# Altium schematic sheet AV Channel.SchDoc
size A4
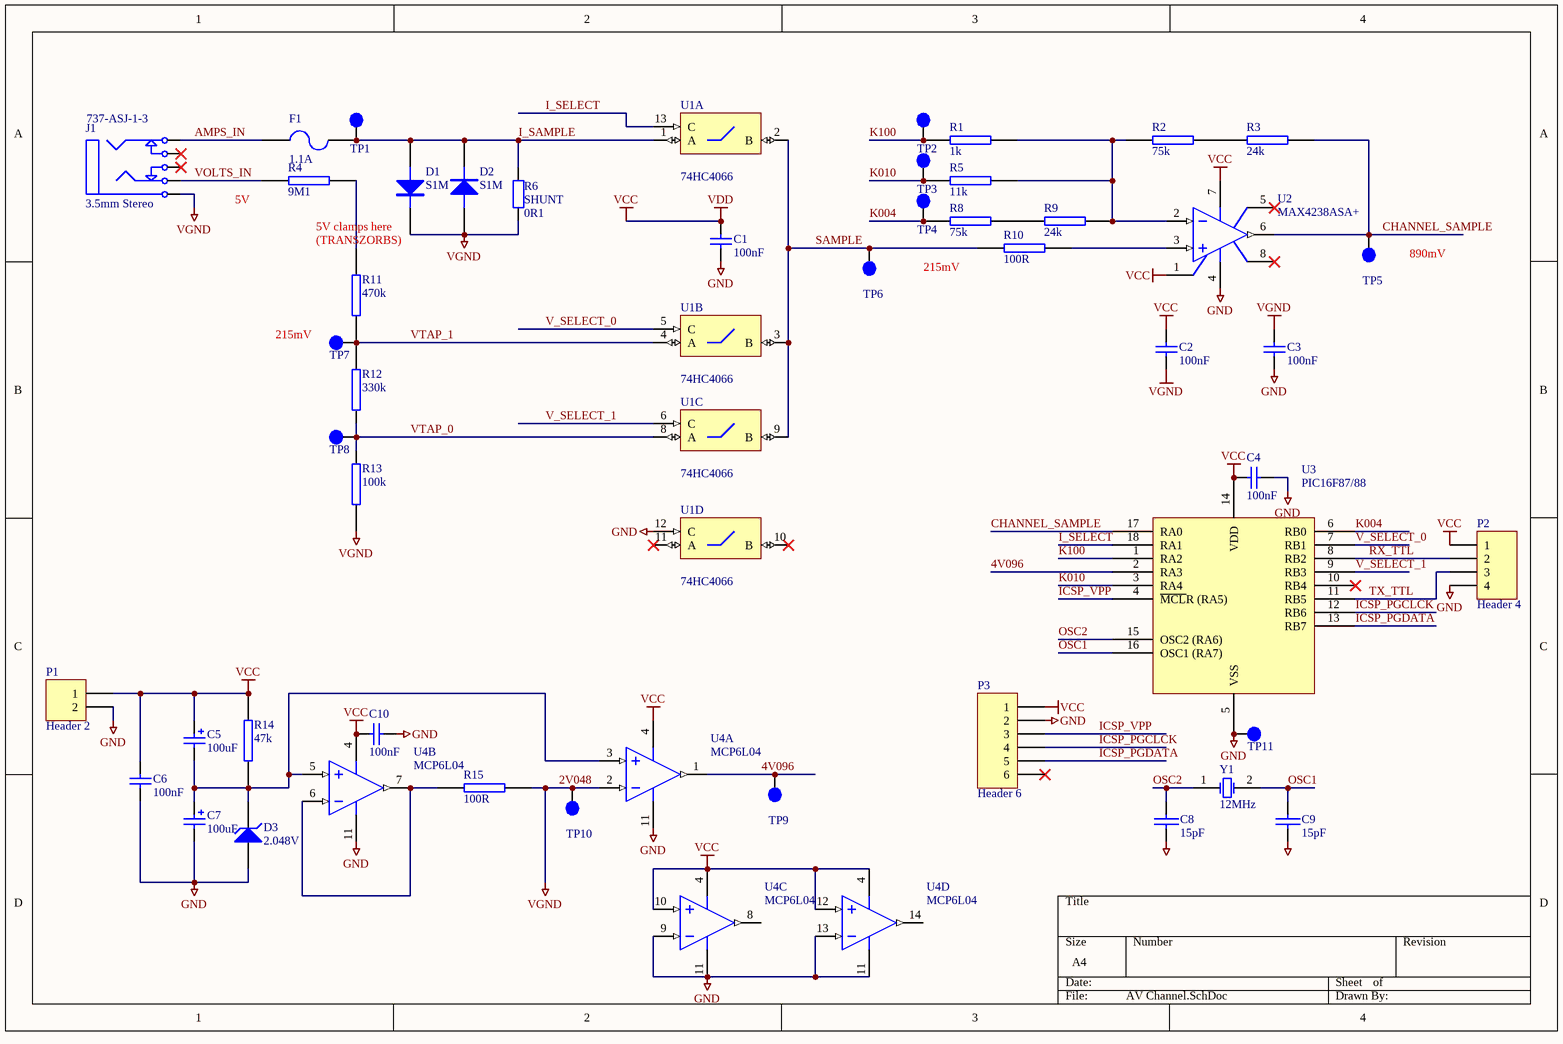
[diagram p0: AV Channel.SchDoc]

## Parts
C1  100nF  [CAP (3D) - 0805]
C2  100nF  [CAP (3D) - 0805]
C3  100nF  [CAP (3D) - 0805]
C4  100nF  [CAP (3D) - 0805]
C5  100uF  [RB5-10.5]
C6  100nF  [CAP (3D) - 0805]
C7  100uF  [RB5-10.5]
C8  15pF  [CAP (3D) - 0805]
C9  15pF  [CAP (3D) - 0805]
C10  100nF  [CAP (3D) - 0805]
D1  S1M  [DO-214AC]
D2  S1M  [DO-214AC]
D3  2.048V  [SOT23-3L]
F1  1.1A  [LITTELFUSE 1210]
J1  3.5mm Stereo  Supplier Part Number 1: 737-ASJ-1-3  [3.5MM pcb mouNt]
P1  Header 2  [HDR1X2]
P2  Header 4  [HDR1X4]
P3  Header 6  [HDR1X6]
R1  1k  [RES (3D) - 0805]
R2  75k  [RES (3D) - 0805]
R3  24k  [RES (3D) - 0805]
R4  9M1  [RES (3D) - 0805]
R5  11k  [RES (3D) - 0805]
R6  SHUNT  value 0R1  [5W WW]
R8  75k  [RES (3D) - 0805]
R9  24k  [RES (3D) - 0805]
R10  100R  [RES (3D) - 0805]
R11  470k  [RES (3D) - 0805]
R12  330k  [RES (3D) - 0805]
R13  100k  [RES (3D) - 0805]
R14  47k  [RES (3D) - 0805]
R15  100R  [RES (3D) - 0805]
TP1  TestPoint  [TP]  (value not drawn)
TP2  TestPoint  [TP]  (value not drawn)
TP3  TestPoint  [TP]  (value not drawn)
TP4  TestPoint  [TP]  (value not drawn)
TP5  TestPoint  [TP]  (value not drawn)
TP6  TestPoint  [TP]  (value not drawn)
TP7  TestPoint  [TP]  (value not drawn)
TP8  TestPoint  [TP]  (value not drawn)
TP9  TestPoint  [TP]  (value not drawn)
TP10  TestPoint  [TP]  (value not drawn)
TP11  TestPoint  [TP]  (value not drawn)
U1  74HC4066  [DIP-14]  (parts A,B,C,D of 4)
U2  MAX4238ASA+  [SO-8]
U3  PIC16F87/88  [SOIC-18]
U4  MCP6L04  [SO-14]  (parts A,B,C,D of 4)
Y1  12MHz  [HC49/4H_SMX]

## Nets
2V048: C2.1 C3.2 D1.2(K) D2.1(A) J1.1 R6.1 R13.2 R15.2 TP10.1 U4.2(INA-)  [also labelled VGND]
GND: C1.1 C3.1 C4.2 C6.1 C7.2 C8.2 C9.2 C10.2 D3.2(A) P1.2 P2.4 P3.2 TP11.1 U1.7(GND) U1.12(C) U2.4(VEE) U3.5(VSS) U4.9(INC-) U4.11(VSS) U4.13(INC-)
VCC: C1.2 C2.2 C4.1 C5.1 C6.2 C10.1 P1.1 P2.1 P3.1 R14.2 U1.14(VDD) U2.1(NULL) U2.7(VCC) U3.14(VDD) U4.4(VDD) U4.10(INC+) U4.12(INC+)  [also labelled VDD]
4V096: TP9.1 U3.2(RA3) U4.1(OUTA)
AMPS_IN: F1.1 J1.5
CHANNEL_SAMPLE: R3.2 TP5.1 U2.6(OUT) U3.17(RA0)
I_SAMPLE: D1.1(A) D2.2(K) F1.2 R6.2 TP1.1 U1.1(A)
I_SELECT: U1.13(C) U3.18(RA1)
ICSP_PGCLCK: P3.4 U3.12(RB6)
ICSP_PGDATA: P3.5 U3.13(RB7)
ICSP_VPP: P3.3 U3.4(~{MCL}R_(RA5))
K004: R8.1 TP4.1 U3.6(RB0)
K010: R5.1 TP3.1 U3.3(RA4)
K100: R1.1 TP2.1 U3.1(RA2)
OSC1: C9.1 U3.16(OSC1_(RA7)) Y1.2(OSC2)
OSC2: C8.1 U3.15(OSC2_(RA6)) Y1.1(OSC1)
RX_TTL: P2.2 U3.8(RB2)
SAMPLE: R10.1 TP6.1 U1.2(B) U1.3(B) U1.9(B)
TX_TTL: P2.3 U3.11(RB5)
V_SELECT_0: U1.5(C) U3.7(RB1)
V_SELECT_1: U1.6(C) U3.9(RB3)
VOLTS_IN: J1.2 R4.1
VTAP_0: R12.2 R13.1 TP8.1 U1.8(A)
VTAP_1: R11.2 R12.1 TP7.1 U1.4(A)
NetC5_2: C5.2 C7.1 D3.1(K) R14.1 U4.3(INA+) U4.5(INB+)
NetR1_2: R1.2 R2.1 R5.2 R9.2 U2.2(IN-)
NetR2_2: R2.2 R3.1
NetR4_2: R4.2 R11.1
NetR8_2: R8.2 R9.1
NetR10_2: R10.2 U2.3(IN+)
NetR15_1: R15.1 U4.6(INB-) U4.7(OUTB)

Not connected (* = marked no-connect by the designer): J1 3* 4*; P3 6*; U1 10(B)* 11(A)*; U2 5(NULL)* 8(NC)*; U3 10(RB4)*; U4 8(OUTC) 14(OUTD)

## Notes on the sheet
- 5V
- (near D1) 5V clamps here
- (TRANSZORBS)
- 215mV
- (near TP5) 890mV

## Library data of the parts
C1-C4 C6 C10 = Cap: Capacitor; Value: 100nF; Supplier 1: Mouser; Supplier 2: Digi-Key; Supplier Part Number 1: 603-C0603ZRY5V9BB104; Supplier Part Number 2: 311-1343-2-ND
C5 C7 = Cap Pol: CAPACITOR POLARISED TAG B CASE; Manufacturer: Generic Components; Manufacturer Part No.: 293D106X9020B8T; value: 100uF; Mouser Part no.: 74-293D106X9020B8T; Web link: http://au.mouser.com/ProductDetail/Vishay-Sprague/293D106X9020B8T/?qs=sGAEpiMZZMukHu%252bjC5l7YZW4AlqROhXN47lkpjjQgHw%3d
C8 C9 = CAP: CAPACITOR SMD 0402; Manufacturer: Xicon; Manufacturer Part No.: 140-CC504N150J-RC; value: 15pF; Mouser Part no.: 140-CC504N150J-RC; Web link: http://au.mouser.com/ProductDetail/Xicon/140-CC504N150J-RC/?qs=0ZUpllj3bsY%252bl3b%252btrhy8ZRrWnFRAos3
D1 D2 = DIODE: DIODE, POWER; Manufacturer: TAIWAN SEMI; Mouser Part no.: 821-S1M; Manufacturer Part No.: S1M; value: S1M; Web link: http://au.mouser.com/ProductDetail/Taiwan-Semiconductor/S1M/?qs=sGAEpiMZZMtEwUVCuofpuOlSmRjzJonf%252bmrIm0%252bGbjE%3d
D3 = D Zener: LM4040 2.048V Reference; Mouser Part No.: 595-LM4040D20IDBZRG4
F1 = Fuse 2: Fuse; Manufacturer: Littlefuse; Manufacturer Part No.: 1206L110THYR; Revision: July-2002: Re-released for DXP Platform.; Mouser Part No.: 576-1206L110THYR; Value: 1.1A; Web link: http://au.mouser.com/ProductDetail/Littelfuse/1206L110THYR/?qs=sGAEpiMZZMu7EFbsM1w0ne5Dyqsx7igC3NaPmo8Qtk8%3d
J1 = Phonejack Stereo SW: 3-Conductor Jack with 2 break contacts (normals) and 2 auxiliary make contacts; Altronics Part no.: P0073; Manufacturer: Neutrik; Manufacturer Part No.: NMJ6HFD2; Mouser Part no.: 550-20301; Web link: http://au.mouser.com/ProductDetail/Neutrik/NMJ6HFD2/?qs=y5MlCMoPWsng3r9W7xlRqw%3d%3d; Supplier 1: Mouser
P1 = Header 2: Header, 2-Pin; LatestRevisionDate: 17-Jul-2002; LatestRevisionNote: Re-released for DXP Platform.; Publisher: Altium Limited
P2 = Header 4: Header, 4-Pin; LatestRevisionDate: 17-Jul-2002; LatestRevisionNote: Re-released for DXP Platform.; Publisher: Altium Limited
P3 = Header 6: Header, 6-Pin; LatestRevisionDate: 17-Jul-2002; LatestRevisionNote: Re-released for DXP Platform.; Publisher: Altium Limited
R1-R3 R5 R8-R10 R15 = RES SMD 0603: RESISTOR SMD 0603
  R1: value: 1k
  R2 R8: value: 75k
  R3 R9: value: 24k
  R5: value: 11k
  R10 R15: value: 100R
R4 = RES SMD 0603 10k: RESISTOR SMD 0603 10k; Manufacturer: Vishay/Dale; Manufacturer Part No.: CRCW06038M06FKEA; Mouser Part no.: 71-CRCW0603-8.06M-E3; Web link: http://au.mouser.com/ProductDetail/Vishay/CRCW06038M06FKEA/?qs=y%252bMD5VLd6nuCUjzPeM%2fNuA%3d%3d; value: 9M1
R6 = Res2: Resistor; Published: 8-Jun-2000; LatestRevisionDate: 17-Jul-2002; LatestRevisionNote: Re-released for DXP Platform.; PackageReference: AXIAL-0.4; Publisher: Altium Limited; PackageDescription: Axial Device, Thru-Hole; 2 Leads; 0.4 in Pin Spacing
R11-R13 = RES SMD 0603 10k: RESISTOR SMD 0603 10k; Manufacturer: 71-CRCW0603-1.62M-E3; Manufacturer Part No.: CRCW06031M62FKEA; Mouser Part no.: Vishay/Dale; Web link: http://au.mouser.com/ProductDetail/Vishay-Dale/CRCW06031M62FKEA/?qs=T8SocJY5PJGlLyODpclhGBx5u7VrWxQmuiInBv9Pchc%3d
  R11: value: 470k
  R12: value: 330k
  R13: value: 100k
R14 = RES SMD 0603 10k: RESISTOR SMD 0603 10k; Manufacturer: Bourns; Manufacturer Part No.: CR0603FX-1002ELF; Mouser Part no.: 652-CR0603FX-1002ELF; Web link: http://au.mouser.com/Search/Refine.aspx?Keyword=652-CR0603FX-1002ELF; value: 47k
U1 = 74HC4066: Quadruple Bilateral Analog Switch
U2 = MAX495CSA: Single Voltage-Feedback Operational Amplifier; Published: 23-Sep-2002; LatestRevisionDate: 13-Apr-2006; LatestRevisionNote: IPC-7351 Footprint Added.; DatasheetVersion: Rev 2; 9/96; PackageReference: NSO8; Publisher: Altium Limited; PackageDescription: 8-Pin Small Outline Integrated Circuit 1.27 mm Pitch; Code_JEDEC: MS-012-AA; Code_IPC: SOIC127P600-8; ComponentLink1Description: Manufacturer Link; ComponentLink1URL: http://www.maxim-ic.com/; ComponentLink2Description: Datasheet; ComponentLink2URL: http://pdfserv.maxim-ic.com/en/ds/MAX492-MAX495.pdf
U3 = PIC16F87/88: PIC16F88; Manufacturer: Microchip Technology; Manufacturer Part No.: PIC16F88-E/SS; Mouser Part no.: 579-PIC16F88-E/SS; Farnell Part no.: 9761519; value: PIC16F88; Web link: http://au.mouser.com/ProductDetail/Microchip-Technology/PIC16F88-E-SS/?qs=sGAEpiMZZMvu0Nwh4cA1waDrdroEY0RCb%252bRi%252b4Dz0K0%3d
Y1 = XTAL: Crystal Oscillator; Manufacturer: ECS; Manufacturer Part No.: ECS-160-20-5PX-TR; value: 16MHz; Mouser Part no.: 520-CSM1600-20-X; Web link: http://au.mouser.com/ProductDetail/ECS/ECS-160-20-5PX-TR/?qs=CkbNAJEAr%2fRSmE52Hssuc4XnCMYWVt7B
U4 = MCP6L04: Value: MCP6L04